# EasyEDA schematic SCH_CatDoor_2024-03-03.json
TITLE: Sheet_1; REV: 1.0; Date: 2024-01-22; Sheet: 1/1; Drawn By: t6fJ; Company: Your Company
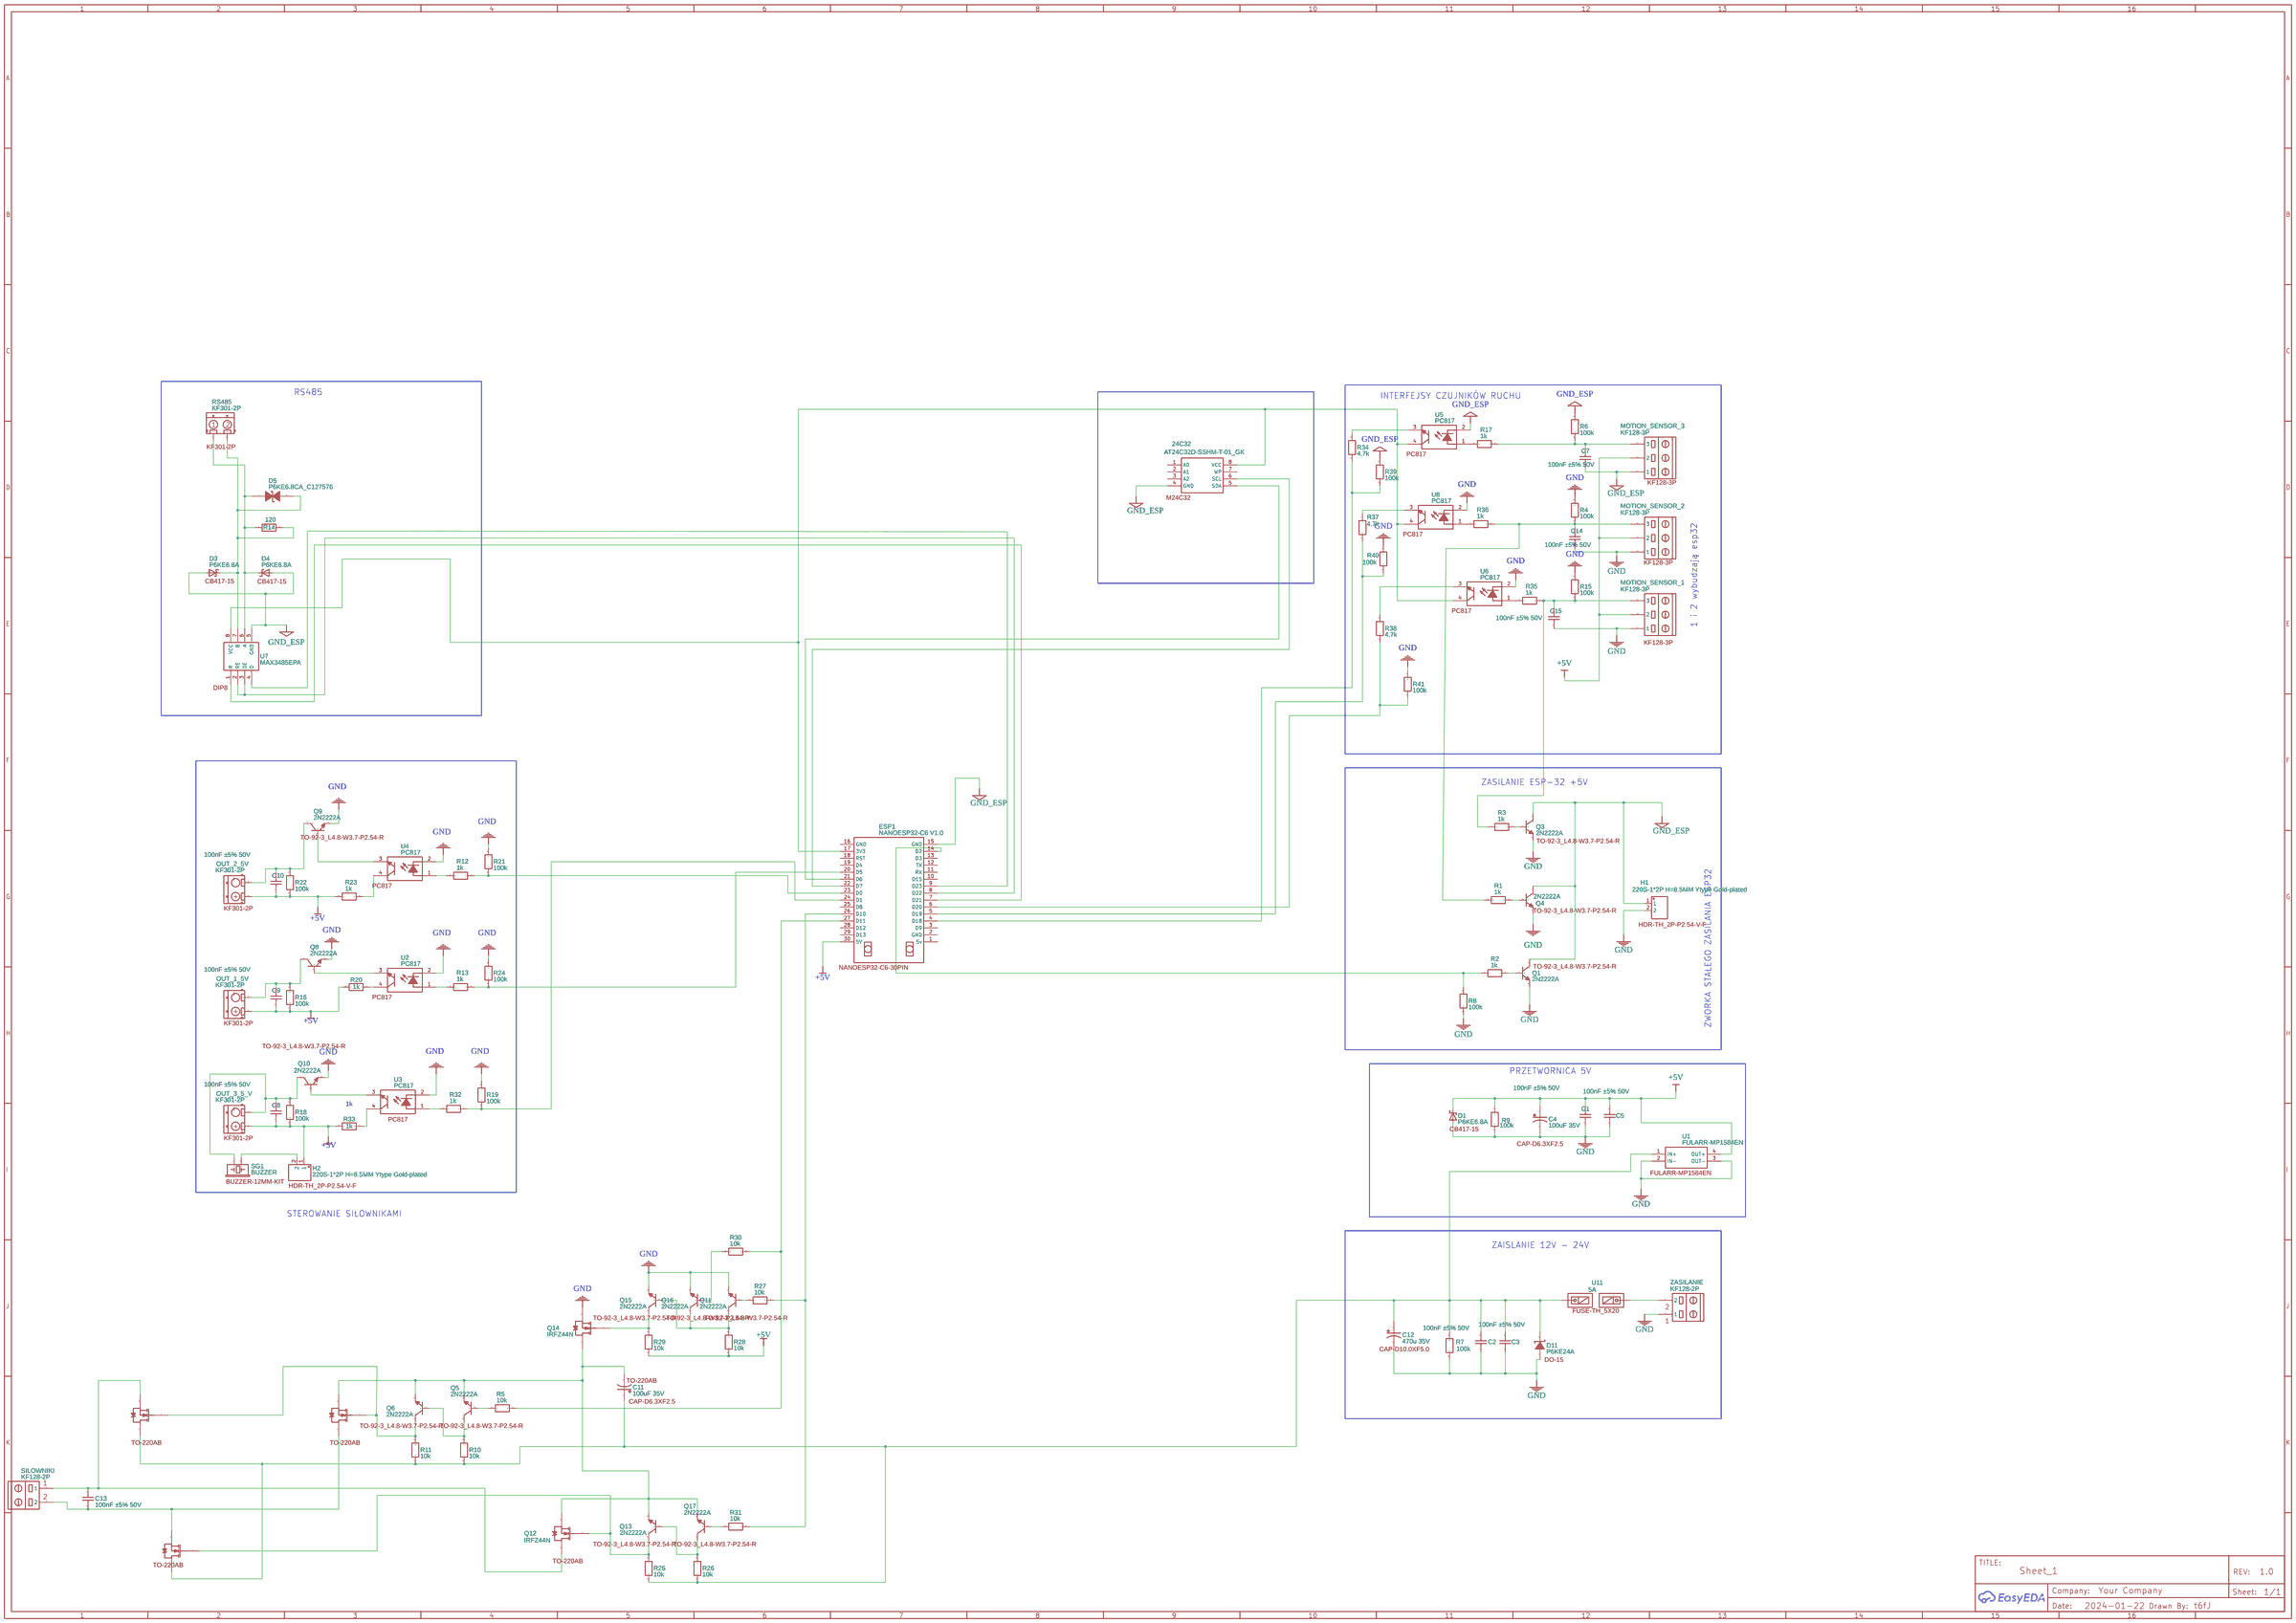
[diagram p0: schematic sheet]

## Parts
24C32  AT24C32D-SSHM-T-01_GK  [M24C32]
C1  100nF ±5% 50V  [CAP-2.5*6*7]
C2  100nF ±5% 50V  [CAP-2.5*6*7]
C3  100nF ±5% 50V  [CAP-2.5*6*7]
C4  100uF 35V  [CAP-D6.3XF2.5]
C5  100nF ±5% 50V  [CAP-2.5*6*7]
C7  100nF ±5% 50V  [CAP-2.5*6*7]
C8  100nF ±5% 50V  [CAP-2.5*6*7]
C9  100nF ±5% 50V  [CAP-2.5*6*7]
C10  100nF ±5% 50V  [CAP-2.5*6*7]
C11  100uF 35V  [CAP-D6.3XF2.5]
C12  470u 35V  [CAP-D10.0XF5.0]
C13  100nF ±5% 50V  [CAP-2.5*6*7]
C14  100nF ±5% 50V  [CAP-2.5*6*7]
C15  100nF ±5% 50V  [CAP-2.5*6*7]
D1  P6KE6.8A  [CB417-15]
D3  P6KE6.8A  [CB417-15]
D4  P6KE6.8A  [CB417-15]
D5  P6KE6.8CA_C127576  [DO-15_BD3.1-L6.7-P10.70-D0.9-BI]
D11  P6KE24A  [DO-15]
ESP1  NANOESP32-C6 V1.0  [NANOESP32-C6-30PIN]
H1  220S-1*2P H=8.5MM Ytype Gold-plated  [HDR-TH_2P-P2.54-V-F]
H2  220S-1*2P H=8.5MM Ytype Gold-plated  [HDR-TH_2P-P2.54-V-F]
MOTION_SENSOR_1  KF128-3P  [KF128-3P]
MOTION_SENSOR_2  KF128-3P  [KF128-3P]
MOTION_SENSOR_3  KF128-3P  [KF128-3P]
OUT_1_5V  KF301-2P  [KF301-2P]
OUT_2_5V  KF301-2P  [KF301-2P]
OUT_3_5_V  KF301-2P  [KF301-2P]
Q1  2N2222A  [TO-92-3_L4.8-W3.7-P2.54-R]
Q2  IRFZ44N  [TO-220AB]
Q3  2N2222A  [TO-92-3_L4.8-W3.7-P2.54-R]
Q4  2N2222A  [TO-92-3_L4.8-W3.7-P2.54-R]
Q5  2N2222A  [TO-92-3_L4.8-W3.7-P2.54-R]
Q6  2N2222A  [TO-92-3_L4.8-W3.7-P2.54-R]
Q7  IRFZ44N  [TO-220AB]
Q8  2N2222A  [TO-92-3_L4.8-W3.7-P2.54-R]
Q9  2N2222A  [TO-92-3_L4.8-W3.7-P2.54-R]
Q10  2N2222A  [TO-92-3_L4.8-W3.7-P2.54-R]
Q11  2N2222A  [TO-92-3_L4.8-W3.7-P2.54-R]
Q12  IRFZ44N  [TO-220AB]
Q13  2N2222A  [TO-92-3_L4.8-W3.7-P2.54-R]
Q14  IRFZ44N  [TO-220AB]
Q15  2N2222A  [TO-92-3_L4.8-W3.7-P2.54-R]
Q16  2N2222A  [TO-92-3_L4.8-W3.7-P2.54-R]
Q17  2N2222A  [TO-92-3_L4.8-W3.7-P2.54-R]
Q18  IRFZ44N  [TO-220AB]
R1  1k  [R_AXIAL-0.3]
R2  1k  [R_AXIAL-0.3]
R3  1k  [R_AXIAL-0.3]
R4  100k  [R_AXIAL-0.3]
R5  10k  [R_AXIAL-0.3]
R6  100k  [R_AXIAL-0.3]
R7  100k  [R_AXIAL-0.3]
R8  100k  [R_AXIAL-0.3]
R9  100k  [R_AXIAL-0.3]
R10  10k  [R_AXIAL-0.3]
R11  10k  [R_AXIAL-0.3]
R12  1k  [R_AXIAL-0.3]
R13  1k  [R_AXIAL-0.3]
R14  120  [R_AXIAL-0.3]
R15  100k  [R_AXIAL-0.3]
R16  100k  [R_AXIAL-0.3]
R17  1k  [R_AXIAL-0.3]
R18  100k  [R_AXIAL-0.3]
R19  100k  [R_AXIAL-0.3]
R20  1k  [R_AXIAL-0.3]
R21  100k  [R_AXIAL-0.3]
R22  100k  [R_AXIAL-0.3]
R23  1k  [R_AXIAL-0.3]
R24  100k  [R_AXIAL-0.3]
R25  10k  [R_AXIAL-0.3]
R26  10k  [R_AXIAL-0.3]
R27  10k  [R_AXIAL-0.3]
R28  10k  [R_AXIAL-0.3]
R29  10k  [R_AXIAL-0.3]
R30  10k  [R_AXIAL-0.3]
R31  10k  [R_AXIAL-0.3]
R32  1k  [R_AXIAL-0.3]
R33  1k  [R_AXIAL-0.3]
R34  4,7k  [R_AXIAL-0.3]
R35  1k  [R_AXIAL-0.3]
R36  1k  [R_AXIAL-0.3]
R37  4,7k  [R_AXIAL-0.3]
R38  4,7k  [R_AXIAL-0.3]
R39  100k  [R_AXIAL-0.3]
R40  100k  [R_AXIAL-0.3]
R41  100k  [R_AXIAL-0.3]
RS485  KF301-2P  [KF301-2P]
SG1  BUZZER  [BUZZER-12MM-KIT]
SILOWNIKI  KF128-2P  [KF128-2P]
U1  FULARR-MP1584EN  [FULARR-MP1584EN]
U2  PC817  [PC817]
U3  PC817  [PC817]
U4  PC817  [PC817]
U5  PC817  [PC817]
U6  PC817  [PC817]
U7  MAX3485EPA  [DIP8]
U8  PC817  [PC817]
U11  5A  [FUSE-TH_5X20]
ZASILANIE  KF128-2P  [KF128-2P]

## Library data of the parts
24C32 = AT24C32D-SSHM-T-01_GK: Supplier Part: C60583; Supplier: LCSC; Manufacturer: MICROCHIP; Manufacturer Part: AT24C32D-SSHM-T; image: //image.lceda.cn/szlcsc/C60583.jpg; Contributor: t6fJ; Package Display: Yes
C1-C3 C5 C7-C10 C13-C15 = 10nF(103) ±5% 100V: Supplier Part: undefined; Supplier: LCSC; Manufacturer: ReliaPro; Package Display: No
C4 C11 = Cap_Electrolytic(TH)_D6.3XF2.5_US: Package Display: Yes
C12 = Cap_Electrolytic(TH)_D10.0XF5.0_US: Package Display: Yes
D1 D3 D4 = P6KEXX: Contributor: Umang Patel; Package Display: Yes
D5 = P6KE6.8CA_C127576: Supplier: LCSC; Manufacturer: Yenji; Manufacturer Part: P6KE6.8CA; Contributor: LCSC; Supplier Part: C127576; Package Display: No
D11 = P6KE30A_C133726: Supplier: LCSC; Manufacturer: STMicroelectronics; Manufacturer Part: P6KE30A; Contributor: LCSC; Supplier Part: C133726; Package Display: Yes
ESP1 = NANOESP32-C6 V1.0: Contributor: balazs.csanyi07; link: https://lastminuteengineers.com/esp32-pinout-reference/; Package Display: Yes
H1 H2 = 220S-1*2P H=8.5MM Ytype Gold-plated: Contributor: LCSC; Supplier: LCSC; Manufacturer: Ckmtw(灿科盟); Manufacturer Part: B-2200S02P-A120; Supplier Part: C124411; JLCPCB Part Class: Extended Part; Package Display: Yes
MOTION_SENSOR_1-MOTION_SENSOR_3 = KF128-3P: Manufacturer Part: P?; Supplier Part: undefined; Contributor: iarugp; Package Display: Yes
OUT_1_5V OUT_2_5V OUT_3_5_V RS485 = KF301-2P: Contributor: Leandro Puerari; sourceId: lZSaQmEWC; Package Display: Yes
Q1 Q3-Q6 Q9-Q11 Q13 Q15-Q17 = 2N2222A: Supplier: LCSC; Supplier Part: C358533; Manufacturer: Foshan Blue Rocket Elec; Contributor: LCSC; Package Display: Yes
Q2 Q7 Q12 Q14 Q18 = IRF1404: HEXFET Power MOSFET; Package Display: Yes
Q8 = 2N2222A: Supplier: LCSC; Supplier Part: C358533; Manufacturer: Foshan Blue Rocket Elec; Contributor: LCSC; Package Display: No
R1-R41 = R_AXIAL-0.3_EU: Contributor: LCEDA_Lib; Package Display: No
SG1 = BUZZER: Contributor: SparkFun; Package Display: Yes
SILOWNIKI ZASILANIE = KF128-2P: Supplier Part: undefined; Contributor: vetal92; Package Display: No
U1 = FULARR-MP1584EN: Contributor: fsadrzad; Package Display: Yes
U2-U6 U8 = PC817: Supplier: LCSC; Supplier Part: C410323; Manufacturer: Sharp Microelectronics; Manufacturer Part: PC817X1NSZ2B; Contributor: LCSC; Package Display: Yes
U7 = MAX485: Contributor: koosjr; Package Display: Yes
U11 = FUSE_5x20: Supplier: LCSC; Manufacturer: XCFuse; Manufacturer Part: 5x20 RHOS Fuse clip/seat; image: //image.lceda.cn/szlcsc/C3130.jpg; Contributor: michaldodo; Supplier Part: C3130; Package Display: Yes

## Nets
+5V: C1.2 C4.1 C5.2 C8.1 C9.1 C10.1 D1.C ESP1.30(5V) H2.1 MOTION_SENSOR_1.2 MOTION_SENSOR_2.2 MOTION_SENSOR_3.2 OUT_1_5V.1 OUT_2_5V.1 OUT_3_5_V.1 R9.1 R16.2 R18.2 R20.2 R22.2 R23.2 R28.1 R29.1 R33.2 U1.4(OUT+)
GND: C1.1 C2.1 C3.1 C4.2 C5.1 C12.2 C14.1 C15.1 D1.A D11.1(A) H1.2 MOTION_SENSOR_1.1 MOTION_SENSOR_2.1 Q1.3(E) Q3.3(E) Q4.3(E) Q8.3(E) Q9.3(E) Q10.3(E) Q11.3(E) Q14.3(S) Q15.3(E) Q16.3(E) R4.2 R7.2 R8.2 R9.2 R15.2 R19.1 R21.1 R24.1 R40.2 R41.2 U1.2(IN-) U1.3(OUT-) U2.2 U3.2 U4.2 U6.2 U8.2 ZASILANIE.1
GND_ESP: 24C32.4(GND) C7.1 D3.A D4.A ESP1.15(GND) H1.1 MOTION_SENSOR_3.1 Q1.1(C) Q3.1(C) Q4.1(C) R6.2 R39.2 U5.2 U7.5(GND)
Net-(24C32-5): 24C32.5(SDA) ESP1.21(D6)
Net-(24C32-6): 24C32.6(SCL) ESP1.22(D7)
Net-(24C32-8): 24C32.8(VCC) ESP1.17(3V3) U5.4 U6.4 U7.8(VCC) U8.4
Net-(C2-2): C2.2 C3.2 C11.1 C12.1 D11.2(K) Q7.2(D) Q18.2(D) R7.1 R10.1 R11.1 R25.1 R26.1 U1.1(IN+) U11.1
Net-(C7-2): C7.2 MOTION_SENSOR_3.3 R6.1 R17.1
Net-(C8-2): C8.2 OUT_3_5_V.2 Q10.1(C) R18.1 SG1.-(2)
Net-(C9-2): C9.2 OUT_1_5V.2 Q8.1(C) R16.1
Net-(C10-2): C10.2 OUT_2_5V.2 Q9.1(C) R22.1
Net-(C11-2): C11.2 Q2.3(S) Q5.3(E) Q6.3(E) Q12.3(S) Q13.3(E) Q14.2(D) Q17.3(E)
Net-(C13-1): C13.1 Q7.3(S) Q12.2(D) SILOWNIKI.1
Net-(C13-2): C13.2 Q2.2(D) Q18.3(S) SILOWNIKI.2
Net-(C14-2): C14.2 MOTION_SENSOR_2.3 R1.2 R4.1 R36.1
Net-(C15-2): C15.2 MOTION_SENSOR_1.3 R3.2 R15.1 R35.1
Net-(D3-C): D3.C D5.2 R14.2 RS485.2 U7.7(B)
Net-(D4-C): D4.C D5.1 R14.1 RS485.1 U7.6(A)
Net-(ESP1-4): ESP1.4(D18) R34.2 R39.1
Net-(ESP1-5): ESP1.5(D19) R37.2 R40.1
Net-(ESP1-6): ESP1.6(D20) R38.2 R41.1
Net-(ESP1-7): ESP1.7(D21) U7.1(R)
Net-(ESP1-8): ESP1.8(D22) U7.2(RE) U7.3(DE)
Net-(ESP1-9): ESP1.9(D23) U7.4(D)
Net-(ESP1-14): ESP1.14(D2) R2.2 R8.1
Net-(ESP1-20): ESP1.20(D5) R13.1 R24.2
Net-(ESP1-23): ESP1.23(D0) R12.1 R21.2
Net-(ESP1-24): ESP1.24(D1) R19.2 R32.1
Net-(ESP1-26): ESP1.26(D10) R27.2 R31.2
Net-(ESP1-27): ESP1.27(D11) R5.2 R30.2
Net-(H2-2): H2.2 SG1.+(1)
Net-(Q1-2): Q1.2(B) R2.1
Net-(Q2-1): Q2.1(G) Q6.1(C) Q7.1(G) R11.2
Net-(Q3-2): Q3.2(B) R3.1
Net-(Q4-2): Q4.2(B) R1.1
Net-(Q5-1): Q5.1(C) Q6.2(B) R10.2
Net-(Q5-2): Q5.2(B) R5.1
Net-(Q8-2): Q8.2(B) U2.3
Net-(Q9-2): Q9.2(B) U4.3
Net-(Q10-2): Q10.2(B) U3.3
Net-(Q11-1): Q11.1(C) Q15.2(B) Q16.1(C) R28.2
Net-(Q11-2): Q11.2(B) R27.1
Net-(Q12-1): Q12.1(G) Q13.1(C) Q18.1(G) R25.2
Net-(Q13-2): Q13.2(B) Q17.1(C) R26.2
Net-(Q14-1): Q14.1(G) Q15.1(C) R29.2
Net-(Q16-2): Q16.2(B) R30.1
Net-(Q17-2): Q17.2(B) R31.1
Net-(R12-2): R12.2 U4.1
Net-(R13-2): R13.2 U2.1
Net-(R17-2): R17.2 U5.1
Net-(R20-1): R20.1 U2.4
Net-(R23-1): R23.1 U4.4
Net-(R32-2): R32.2 U3.1
Net-(R33-1): R33.1 U3.4
Net-(R34-1): R34.1 U5.3
Net-(R35-2): R35.2 U6.1
Net-(R36-2): R36.2 U8.1
Net-(R37-1): R37.1 U8.3
Net-(R38-1): R38.1 U6.3
Net-(U11-2): U11.2 ZASILANIE.2

Not connected (* = marked no-connect by the designer): 24C32 1(A0) 2(A1) 3(A2) 7(WP); ESP1 1(5v) 2(GND) 3(D9) 10(D15) 11(RX) 12(TX) 13(D3) 16(GND) 18(RST) 19(D4) 25(D8) 28(D12) 29(D13)

## Notes on the sheet
- RS485
- INTERFEJSY CZUJNIKÓW RUCHU
- 1 i 2 wybudzają esp32
- ZASILANIE ESP-32 +5V
- ZWORKA STAŁEGO ZASILANIA ESP32
- PRZETWORNICA 5V
- 1k
- STEROWANIE SIŁOWNIKAMI
- ZAISLANIE 12V - 24V
